# Altium project buck-boost.PrjPcb
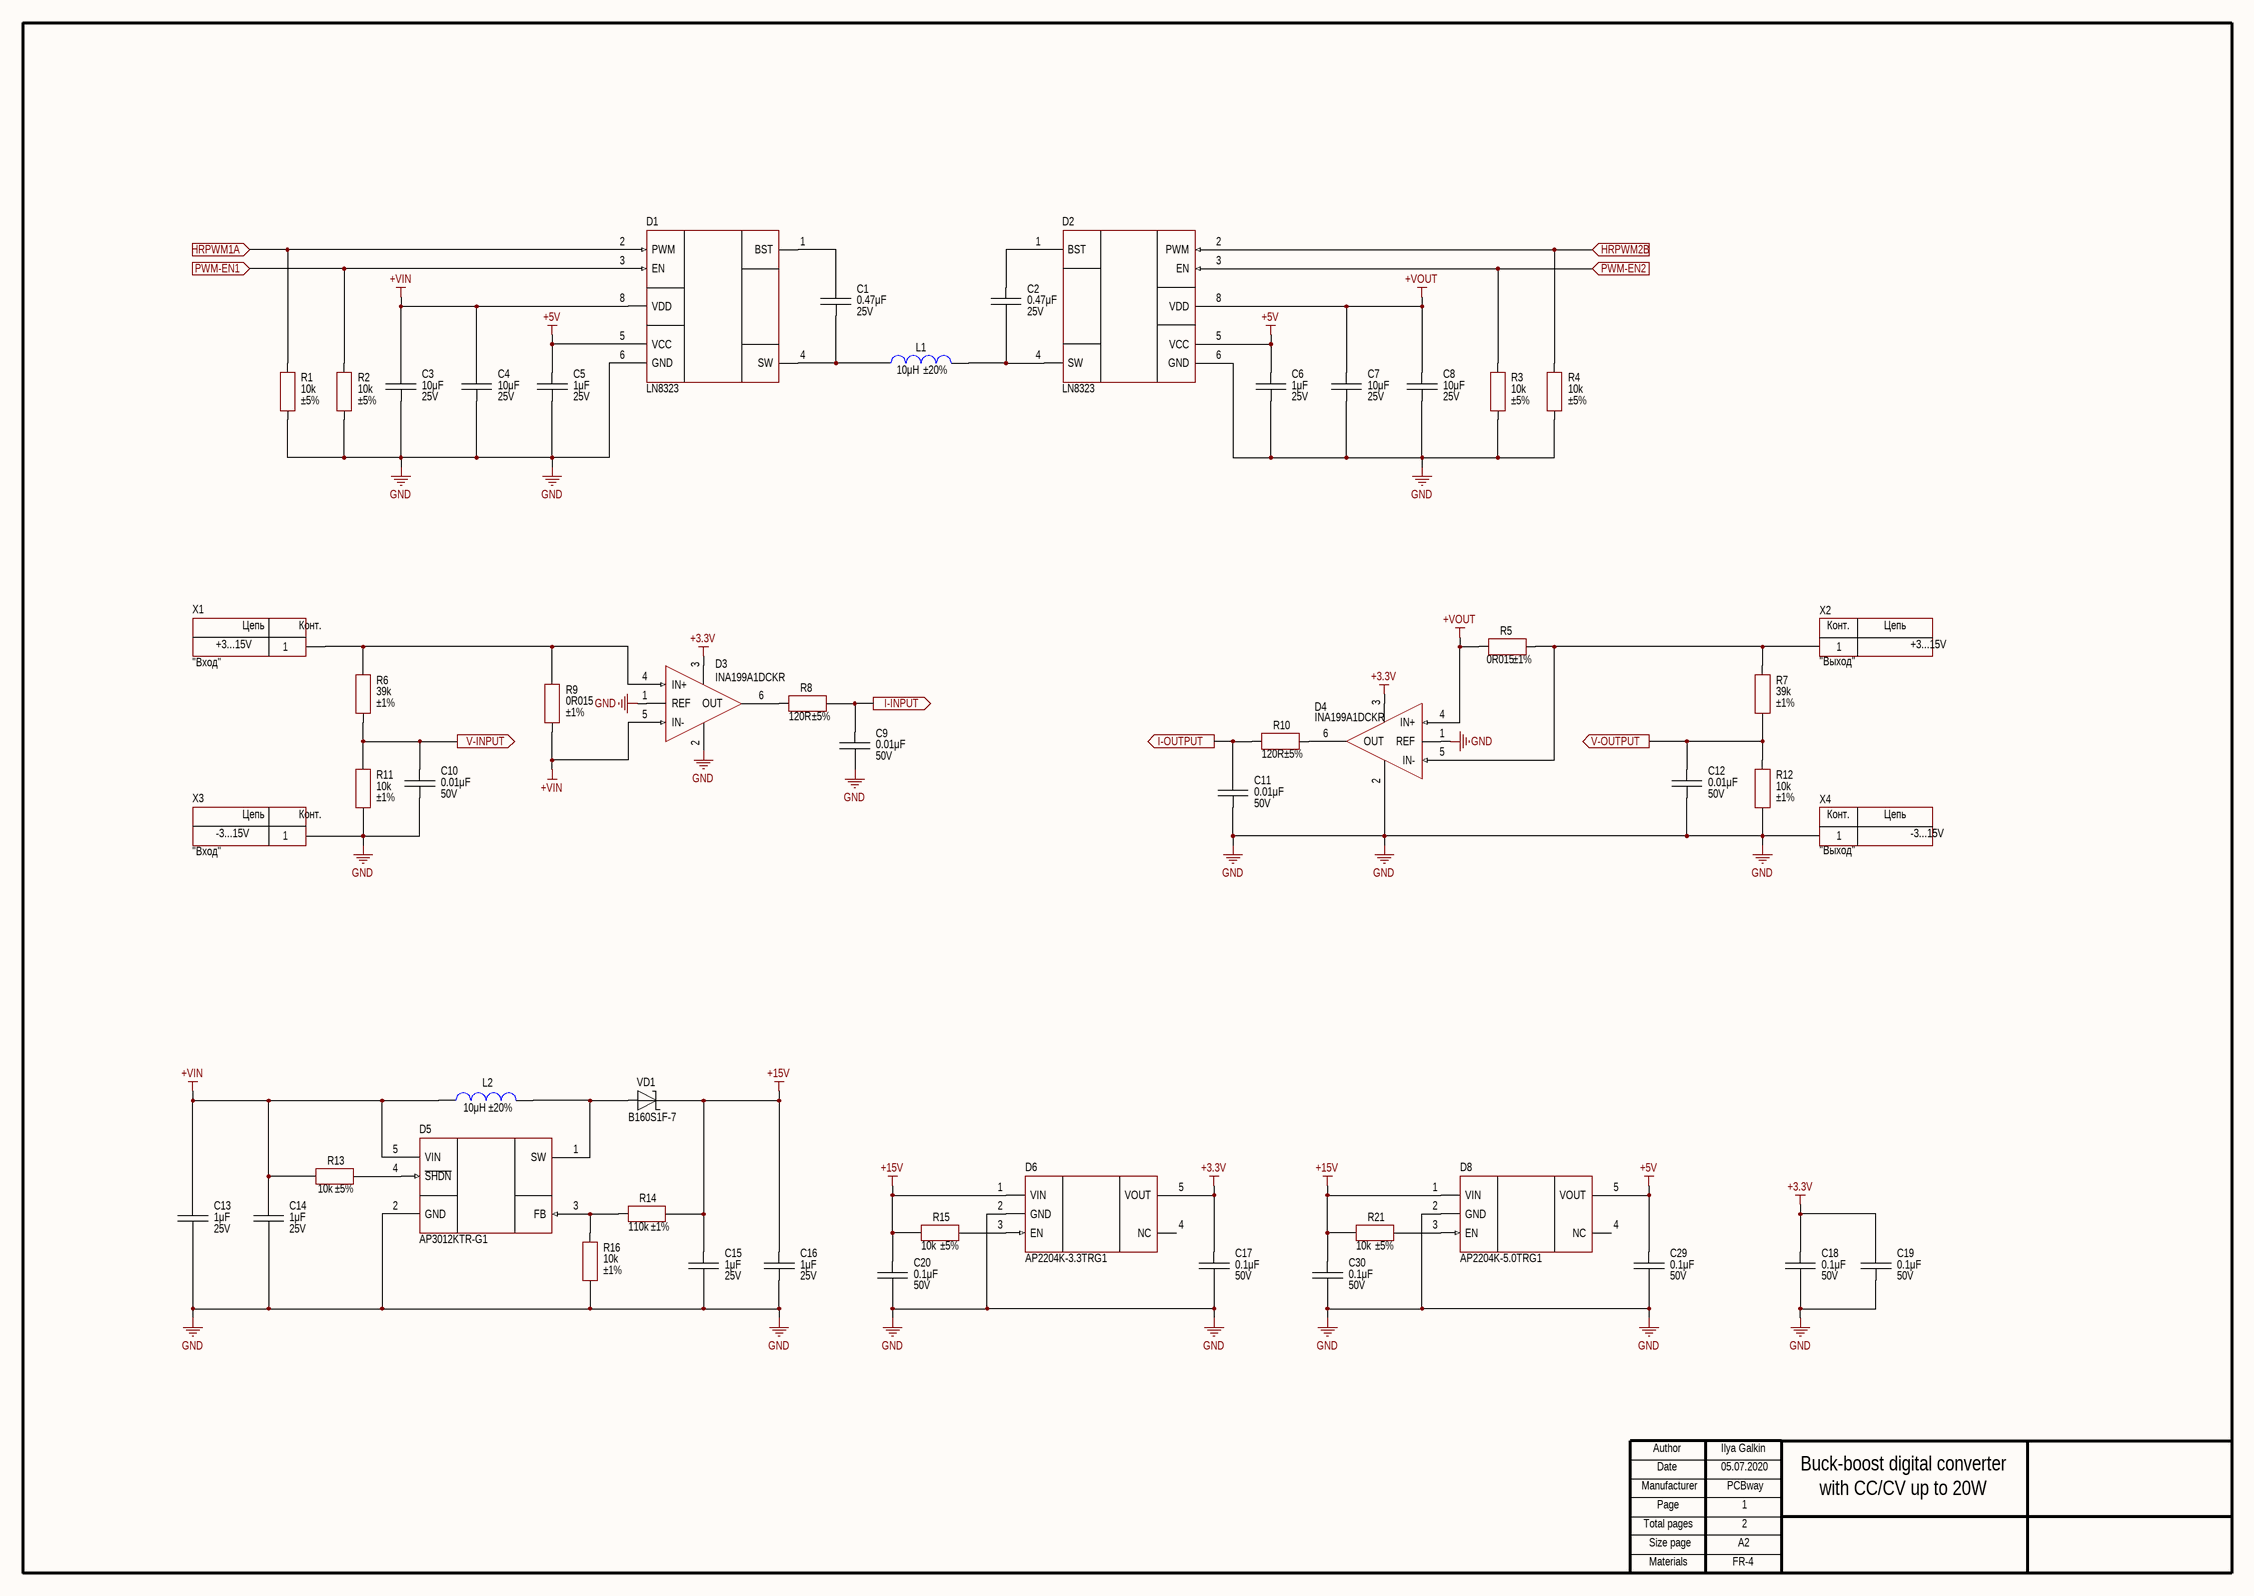
[diagram p0: converter.SchDoc]
2 sheets, 79 parts. Net scope: flat (ports and power ports of the same name join across sheets).
Board file: pcb.PcbDoc
Sheets:
  converter.SchDoc
  dsp.SchDoc

## Sheet converter.SchDoc
size 594 x 420 mm; Address1: Address1; Address2: Address2; Address3: Address3; Address4: Address4; DocumentNumber: АБВГ.123456.001 Э3; SheetNumber: 1; SheetTotal: 2; Scale: 1:1; DocumentType: Схема электрическая принципиальная; FirstReferrence: АБВГ.123456.001

### Parts
(Parts that share a designator on the sheet are numbered #1, #2 ... from top to bottom, then left to right.)
C1  value 0.47μF  Voltage: 25V  [CAP: 0805]
C2  value 0.47μF  Voltage: 25V  [CAP: 0805]
C3  value 10μF  Voltage: 25V  [CAP: 1210]
C4  value 10μF  Voltage: 25V  [CAP: 1210]
C5  value 1μF  Voltage: 25V  [CAP: 0603]
C6  value 1μF  Voltage: 25V  [CAP: 0603]
C7  value 10μF  Voltage: 25V  [CAP: 1210]
C8  value 10μF  Voltage: 25V  [CAP: 1210]
C9  value 0.01μF  Voltage: 50V  [CAP: 0603]
C10  value 0.01μF  Voltage: 50V  [CAP: 0603]
C11  value 0.01μF  Voltage: 50V  [CAP: 0603]
C12  value 0.01μF  Voltage: 50V  [CAP: 0603]
C13  value 1μF  Voltage: 25V  [CAP: 0603]
C14  value 1μF  Voltage: 25V  [CAP: 0603]
C15  value 1μF  Voltage: 25V  [CAP: 0603]
C16  value 1μF  Voltage: 25V  [CAP: 0603]
C17  value 0.1μF  Voltage: 50V  [CAP: 0603]
C18  value 0.1μF  Voltage: 50V  [CAP: 0603]
C19  value 0.1μF  Voltage: 50V  [CAP: 0603]
C20  value 0.1μF  Voltage: 50V  [CAP: 0603]
C29#1  value 0.1μF  Voltage: 50V  [CAP: 0603]
C30#1  value 0.1μF  Voltage: 50V  [CAP: 0603]
D1  (no value)  [8-SOIC-PAD]
D2  (no value)  [8-SOIC-PAD]
D3  (no value)  [SC70-6]
D4  (no value)  [SC70-6]
D5  (no value)  [SOT23-5]
D6#1  (no value)  [SOT23-5]
D8  PartNumber: AP2204K-5.0TRG1  [SOT23-5]
L1  value 10μH  Tolerance: ±20%  [IND: SRP1038C]
L2  value 10μH  Tolerance: ±20%  [IND: SDR0403]
R1  value 10k  Tolerance: ±5%  [RES: 0603]
R2  value 10k  Tolerance: ±5%  [RES: 0603]
R3  value 10k  Tolerance: ±5%  [RES: 0603]
R4  value 10k  Tolerance: ±5%  [RES: 0603]
R5  value 0R015  Tolerance: ±1%  [RES: CSS2H (2512)]
R6  value 39k  Tolerance: ±1%  [RES: 0603]
R7  value 39k  Tolerance: ±1%  [RES: 0603]
R8  value 120R  Tolerance: ±5%  [RES: 0603]
R9  value 0R015  Tolerance: ±1%  [RES: CSS2H (2512)]
R10  value 120R  Tolerance: ±5%  [RES: 0603]
R11  value 10k  Tolerance: ±1%  [RES: 0603]
R12  value 10k  Tolerance: ±1%  [RES: 0603]
R13  value 10k  Tolerance: ±5%  [RES: 0603]
R14  value 110k  Tolerance: ±1%  [RES: 0603]
R15  value 10k  Tolerance: ±5%  [RES: 0603]
R16  value 10k  Tolerance: ±1%  [RES: 0603]
R21  value 10k  Tolerance: ±5%  [RES: 0603]
VD1  PartNumber: B160S1F-7  [DIODE: SOD123F]
X1  CommentText: "Вход"  [CON: 8191]
X2  CommentText: "Выход"  [CON: 8191]
X3  CommentText: "Вход"  [CON: 8191]
X4  CommentText: "Выход"  [CON: 8191]

### Ports
HRPWM1A (in), HRPWM2B (in), I-INPUT (out), I-OUTPUT (out), PWM-EN1 (in), PWM-EN2 (in), V-INPUT (out), V-OUTPUT (out)

### Nets
+3.3V: C17.2 C18.2 C19.2 D3.3(V+) D4.3(V+) D6#1.5(VOUT)
+5V: C5.2 C6.2 C29#1.2 D1.5(VCC) D2.5(VCC) D8.5(VOUT)
+15V: C15.2 C16.2 C20.2 C30#1.2 D6#1.1(VIN) D8.1(VIN) R14.1 R15.2 R21.2 VD1.2
+VIN: C3.2 C4.2 C13.2 C14.2 D1.8(VDD) D3.5(IN-) D5.5(VIN) L2.2 R9.2 R13.2
+VOUT: C7.2 C8.2 D2.8(VDD) D4.4(IN+) R5.1
GND: C3.1 C4.1 C5.1 C6.1 C7.1 C8.1 C9.1 C10.1 C11.1 C12.1 C13.1 C14.1 C15.1 C16.1 C17.1 C18.1 C19.1 C20.1 C29#1.1 C30#1.1 D1.6(GND) D2.6(GND) D3.1(REF) D3.2(V-) D4.1(REF) D4.2(V-) D5.2(GND) D6#1.2(GND) D8.2(GND) R1.1 R2.1 R3.1 R4.1 R11.1 R12.1 R16.1 X3.1 X4.1
NetC1_1: C1.1 D1.4(SW) L1.2
NetC1_2: C1.2 D1.1(BST)
NetC2_1: C2.1 D2.4(SW) L1.1
NetC2_2: C2.2 D2.1(BST)
NetC9_2: C9.2 R8.2 ; port I-INPUT
NetC10_2: C10.2 R6.1 R11.2 ; port V-INPUT
NetC11_2: C11.2 R10.1 ; port I-OUTPUT
NetC12_2: C12.2 R7.1 R12.2 ; port V-OUTPUT
NetD1_2: D1.2(PWM) R1.2 ; port HRPWM1A
NetD1_3: D1.3(EN) R2.2 ; port PWM-EN1
NetD2_2: D2.2(PWM) R4.2 ; port HRPWM2B
NetD2_3: D2.3(EN) R3.2 ; port PWM-EN2
NetD3_4: D3.4(IN+) R6.2 R9.1 X1.1
NetD3_6: D3.6(OUT) R8.1
NetD4_5: D4.5(IN-) R5.2 R7.2 X2.1
NetD4_6: D4.6(OUT) R10.2
NetD5_1: D5.1(SW) L2.1 VD1.1
NetD5_3: D5.3(FB) R14.2 R16.2
NetD5_4: D5.4(~{SHDN}) R13.1
NetD6#1_3: D6#1.3(EN) R15.1
NetD8_3: D8.3(EN) R21.1

Not connected (* = marked no-connect by the designer): D6#1 4(NC); D8 4(NC)

### Notes on the sheet
- +3...15V
- -3...15V
- Ilya Galkin
- 05.07.2020
- PCBway
- 1
- Buck-boost digital converter
- with CC/CV up to 20W
- 2
- FR-4
- Author
- Manufacturer
- Date
- Page
- Total pages
- Size page
- A2
- Materials
- (in symbol Connector_single_power) Цепь; Конт.

### Library data of the parts
C1 C2 = Ceramic_0805: Manufacturer: Samsung; PartNumber: CL21B474KAFNNNG; ValueManufacturerPartNumber: Ceramic capacitor, 0.47μF, X7R, ±10%, 25V, 0805, -55...+125°C; TypeCapacitor: Ceramic capacitor; Tolerance: ±10%; TypeDielectric: X7R; Package: 0805; HelpURL: https://www.digikey.com/product-detail/en/samsung-electro-mechanics/CL21B474KAFNNNG/1276-6480-1-ND/5958108; Temperature: -55...+125°C
C3 C4 C7 C8 = Ceramic_1210: Manufacturer: Samsung; PartNumber: CL32B106KAJNNNE; ValueManufacturerPartNumber: Ceramic capacitor, 10μF, X7R, ±10%, 25V, 1210, -55...+125°C; TypeCapacitor: Ceramic capacitor; Tolerance: ±10%; TypeDielectric: X7R; Package: 1210; HelpURL: https://www.digikey.com/product-detail/en/samsung-electro-mechanics/CL32B106KAJNNNE/1276-1807-1-ND/3889893; Temperature: -55...+125°C
C5 C6 C13-C16 = Ceramic_0603: Manufacturer: Samsung; PartNumber: CL10B105KA8NNNC; ValueManufacturerPartNumber: Ceramic capacitor, 1μF, X7R, ±10%, 25V, 0603, -55...+125°C; TypeCapacitor: Ceramic capacitor; Tolerance: ±10%; TypeDielectric: X7R; Package: 0603; HelpURL: https://www.digikey.com/product-detail/en/samsung-electro-mechanics/CL10B105KA8NNNC/1276-1184-1-ND/3889270; Temperature: -55...+125°C
C9-C12 = Ceramic_0603: Manufacturer: Yageo; PartNumber: CL10B103KB8NNNC; ValueManufacturerPartNumber: Ceramic capacitor, 0.01μF, X7R, ±10%, 50V, 0603, -55...+125°C; TypeCapacitor: Ceramic capacitor; Tolerance: ±10%; TypeDielectric: X7R; Package: 0603; HelpURL: https://www.digikey.com/product-detail/en/samsung-electro-mechanics/CL10B103KB8NNNC/1276-1009-1-ND/3889095; Temperature: -55...+125°C
C17-C20 C29#1 C30#1 = Ceramic_0603: Manufacturer: Yageo; PartNumber: CL10B104KB8WPND; ValueManufacturerPartNumber: Ceramic capacitor, 0.1μF, X7R, ±10%, 50V, 0603, -55...+125°C; TypeCapacitor: Ceramic capacitor; Tolerance: ±10%; TypeDielectric: X7R; Package: 0603; HelpURL: https://www.digikey.com/product-detail/en/samsung-electro-mechanics/CL10B104KB8WPND/1276-CL10B104KB8WPNDCT-ND/11488014; Temperature: -55...+125°C
D1 D2 = LN8323: Gate driver; Manufacturer: Chipown; ValueManufacturerPartNumber: Half-bridge module, 2N channel, 100kHz, 6A, supply 4...30V, -40...+125°C, 8-SOIC-PAD; VoltageSupply: supply 4...30V; Frequency: 100kHz; CurrentOutput: 6A; VoltageWork: 2N channel; HelpURL: http://chipown.com/product.asp?id=416; Package: 8-SOIC-PAD; ComponentType: Half-bridge module; Temperature: -40...+125°C; PartNumber: LN8323
D3 D4 = INA199A1DCKR: Current monitor; Manufacturer: Texas Instruments; ValueManufacturerPartNumber: IC current monitor, ±1.5%, 50V/V, -0.3...+26V, -40...+125°C, SOT23-5; Supply: -0.3...+26V; Accuracy: ±1.5%; GainBandwidth: 50V/V; HelpURL: https://www.digikey.com/product-detail/en/texas-instruments/INA199A1DCKR/296-27329-1-ND/2279290; Package: SOT23-5; ComponentType: IC current monitor; Temperature: -40...+125°C; PartNumber: INA199A1DCKR
D5 = AP3012KTR-G1: Boost converter; Manufacturer: Diodes Incorporated; ValueManufacturerPartNumber: DC/DC boost converter, input 2.6...16V, 1.5MHz, output 3...29V, 0.5A, -40...+85°C, SOT23-5; VoltageInput: input 2.6...16V; Frequency: 1.5MHz; CurrentOutput: 0.5A; VoltageOutput: output 3...29V; HelpURL: https://www.digikey.com/product-detail/en/diodes-incorporated/AP3012KTR-G1/AP3012KTR-G1DICT-ND/4505297; Package: SOT23-5; ComponentType: DC/DC boost converter; Temperature: -40...+85°C; PartNumber: AP3012KTR-G1
D6#1 = AP2204K-3.3TRG1: Linear voltage regulator; Manufacturer: Diodes Incorporated; ValueManufacturerPartNumber: Linear voltage regulator, input 4...24V, 0.5V, output 3.3V, 0.15A, -40...+85°C, SOT23-6; VoltageInput: input 4...24V; MaxDropout: 0.5V; CurrentOutput: 0.15A; VoltageOutput: output 3.3V; HelpURL: https://www.digikey.com/product-detail/en/diodes-incorporated/AP2204K-3.3TRG1/AP2204K-3.3TRG1DICT-ND/4505288; Package: SOT23-6; ComponentType: Linear voltage regulator; Temperature: -40...+85°C; PartNumber: AP2204K-3.3TRG1
D8 = AP2204K-3.3TRG1: Linear voltage regulator; Manufacturer: Diodes Incorporated; ValueManufacturerPartNumber: Linear voltage regulator, input 4...24V, 0.5V, output 5V, 0.15A, -40...+85°C, SOT23-6; VoltageInput: input 4...24V; MaxDropout: 0.5V; CurrentOutput: 0.15A; VoltageOutput: output 5V; HelpURL: https://www.digikey.com/product-detail/en/diodes-incorporated/AP2204K-5-0TRG1/AP2204K-5-0TRG1DICT-ND/4505289; Package: SOT23-6; ComponentType: Linear voltage regulator; Temperature: -40...+85°C
L1 = Inductor_SRP1038C: Manufacturer: Bourns; PartNumber: SRP1038C-100M; ValueManufacturerPartNumber: Fixed inductor, 10μH, ±20%, SRP1038C, 8.5A, -40...+125°C; TypeInductor: Fixed inductor; MaxCurrent: 8.5A; Package: SRP1038C; HelpURL: https://www.digikey.com/product-detail/en/bourns-inc/SRP1038C-100M/SRP1038C-100MCT-ND/10249149; Temperature: -40...+125°C
L2 = Inductor_SDR0403: Manufacturer: Bourns; PartNumber: SDR0403-100ML; ValueManufacturerPartNumber: Fixed inductor, 10μH, ±20%, SDR0403, 1.15A, -40...+125°C; TypeInductor: Fixed inductor; MaxCurrent: 1.15A; Package: SDR0403; HelpURL: https://www.digikey.com/product-detail/en/bourns-inc/SDR0403-100ML/SDR0403-100MLCT-ND/2127080; Temperature: -40...+125°C
R1-R4 R13 R15 R21 = Resistor_0603: Manufacturer: Yageo; PartNumber: RC0603JR-0710KL; ValueManufacturerPartNumber: Resistor film, 10k, ±5%, 0603, 0.1W, -55...+125°C; TypeResistor: Resistor film; Power: 0.1W; Package: 0603; HelpURL: https://www.digikey.com/product-detail/en/yageo/RC0603JR-0710KL/311-10KGRCT-ND/729647; Temperature: -55...+125°C
R5 R9 = Shunt: Manufacturer: Yageo; PartNumber: PE2512FKE7W0R015L; ValueManufacturerPartNumber: Resistor film, 0R015, ±1%, 2512, 2W, -55...+170°C; TypeResistor: Resistor film; Power: 2W; Package: 2512; HelpURL: https://www.digikey.com/product-detail/en/yageo/PE2512FKE7W0R015L/YAG2165CT-ND/5139613; Temperature: -55...+170°C
R6 R7 = Resistor_0603: Manufacturer: Yageo; PartNumber: RC0603FR-0739KL; ValueManufacturerPartNumber: Resistor film, 39k, ±1%, 0603, 0.1W, -55...+125°C; TypeResistor: Resistor film; Power: 0.1W; Package: 0603; HelpURL: https://www.digikey.com/product-detail/en/yageo/RC0603FR-0739KL/311-39-0KHRCT-ND/730142; Temperature: -55...+125°C
R8 R10 = Resistor_0603: Manufacturer: Yageo; PartNumber: RC0603JR-07120RL; ValueManufacturerPartNumber: Resistor film, 120R, ±5%, 0603, 0.1W, -55...+125°C; TypeResistor: Resistor film; Power: 0.1W; Package: 0603; HelpURL: https://www.digikey.com/product-detail/en/yageo/RC0603JR-07120RL/311-120GRCT-ND/729653; Temperature: -55...+125°C
R11 R12 R16 = Resistor_0603: Manufacturer: Yageo; PartNumber: RC0603FR-0710KL; ValueManufacturerPartNumber: Resistor film, 10k, ±1%, 0603, 0.1W, -55...+125°C; TypeResistor: Resistor film; Power: 0.1W; Package: 0603; HelpURL: https://www.digikey.com/product-detail/en/yageo/RC0603FR-0710KL/311-10-0KHRCT-ND/729827; Temperature: -55...+125°C
R14 = Resistor_0603: Manufacturer: Yageo; PartNumber: RC0603FR-07110KL; ValueManufacturerPartNumber: Resistor film, 110k, ±1%, 0603, 0.1W, -55...+125°C; TypeResistor: Resistor film; Power: 0.1W; Package: 0603; HelpURL: https://www.digikey.com/product-detail/en/yageo/RC0603FR-07110KL/311-110KHRCT-ND/729852; Temperature: -55...+125°C
VD1 = Schottky_single: Manufacturer: Diodes Incorporated; ValueManufacturerPartNumber: Schottky diode, 60B160S1F-7, 1A, 650mV, 45pF, SOD-123F, -55...+150°C; TypeDiode: Schottky diode; Voltage: 60B160S1F-7; Current: 1A; VoltageDrop: 650mV; RecoveryTime: 45pF; Package: SOD-123F; HelpURL: https://www.digikey.com/product-detail/en/diodes-incorporated/B160S1F-7/B160S1F-7DICT-ND/7784161; Temperature: -55...+150°C
X1-X4 = Connector_single_power: Manufacturer: Keystone; ValueManufacturerPartNumber: Power connector, 500V, 15A; PartNumber: 8191; TypeConnector: Power connector; VoltageMax: 500V; CurrentMax: 15A; HelpURL: https://ru.mouser.com/ProductDetail/Keystone-Electronics/8191?qs=lQmX4aIt5iAMQ8PQTpZ%2Fwg%3D%3D

## Sheet dsp.SchDoc
size 420 x 297 mm; Address1: Address1; Address2: Address2; Address3: Address3; Address4: Address4; DocumentNumber: АБВГ.123456.001 Э3; SheetNumber: 2; SheetTotal: 2; Scale: 1:1; DocumentType: Схема электрическая принципиальная; FirstReferrence: АБВГ.123456.001
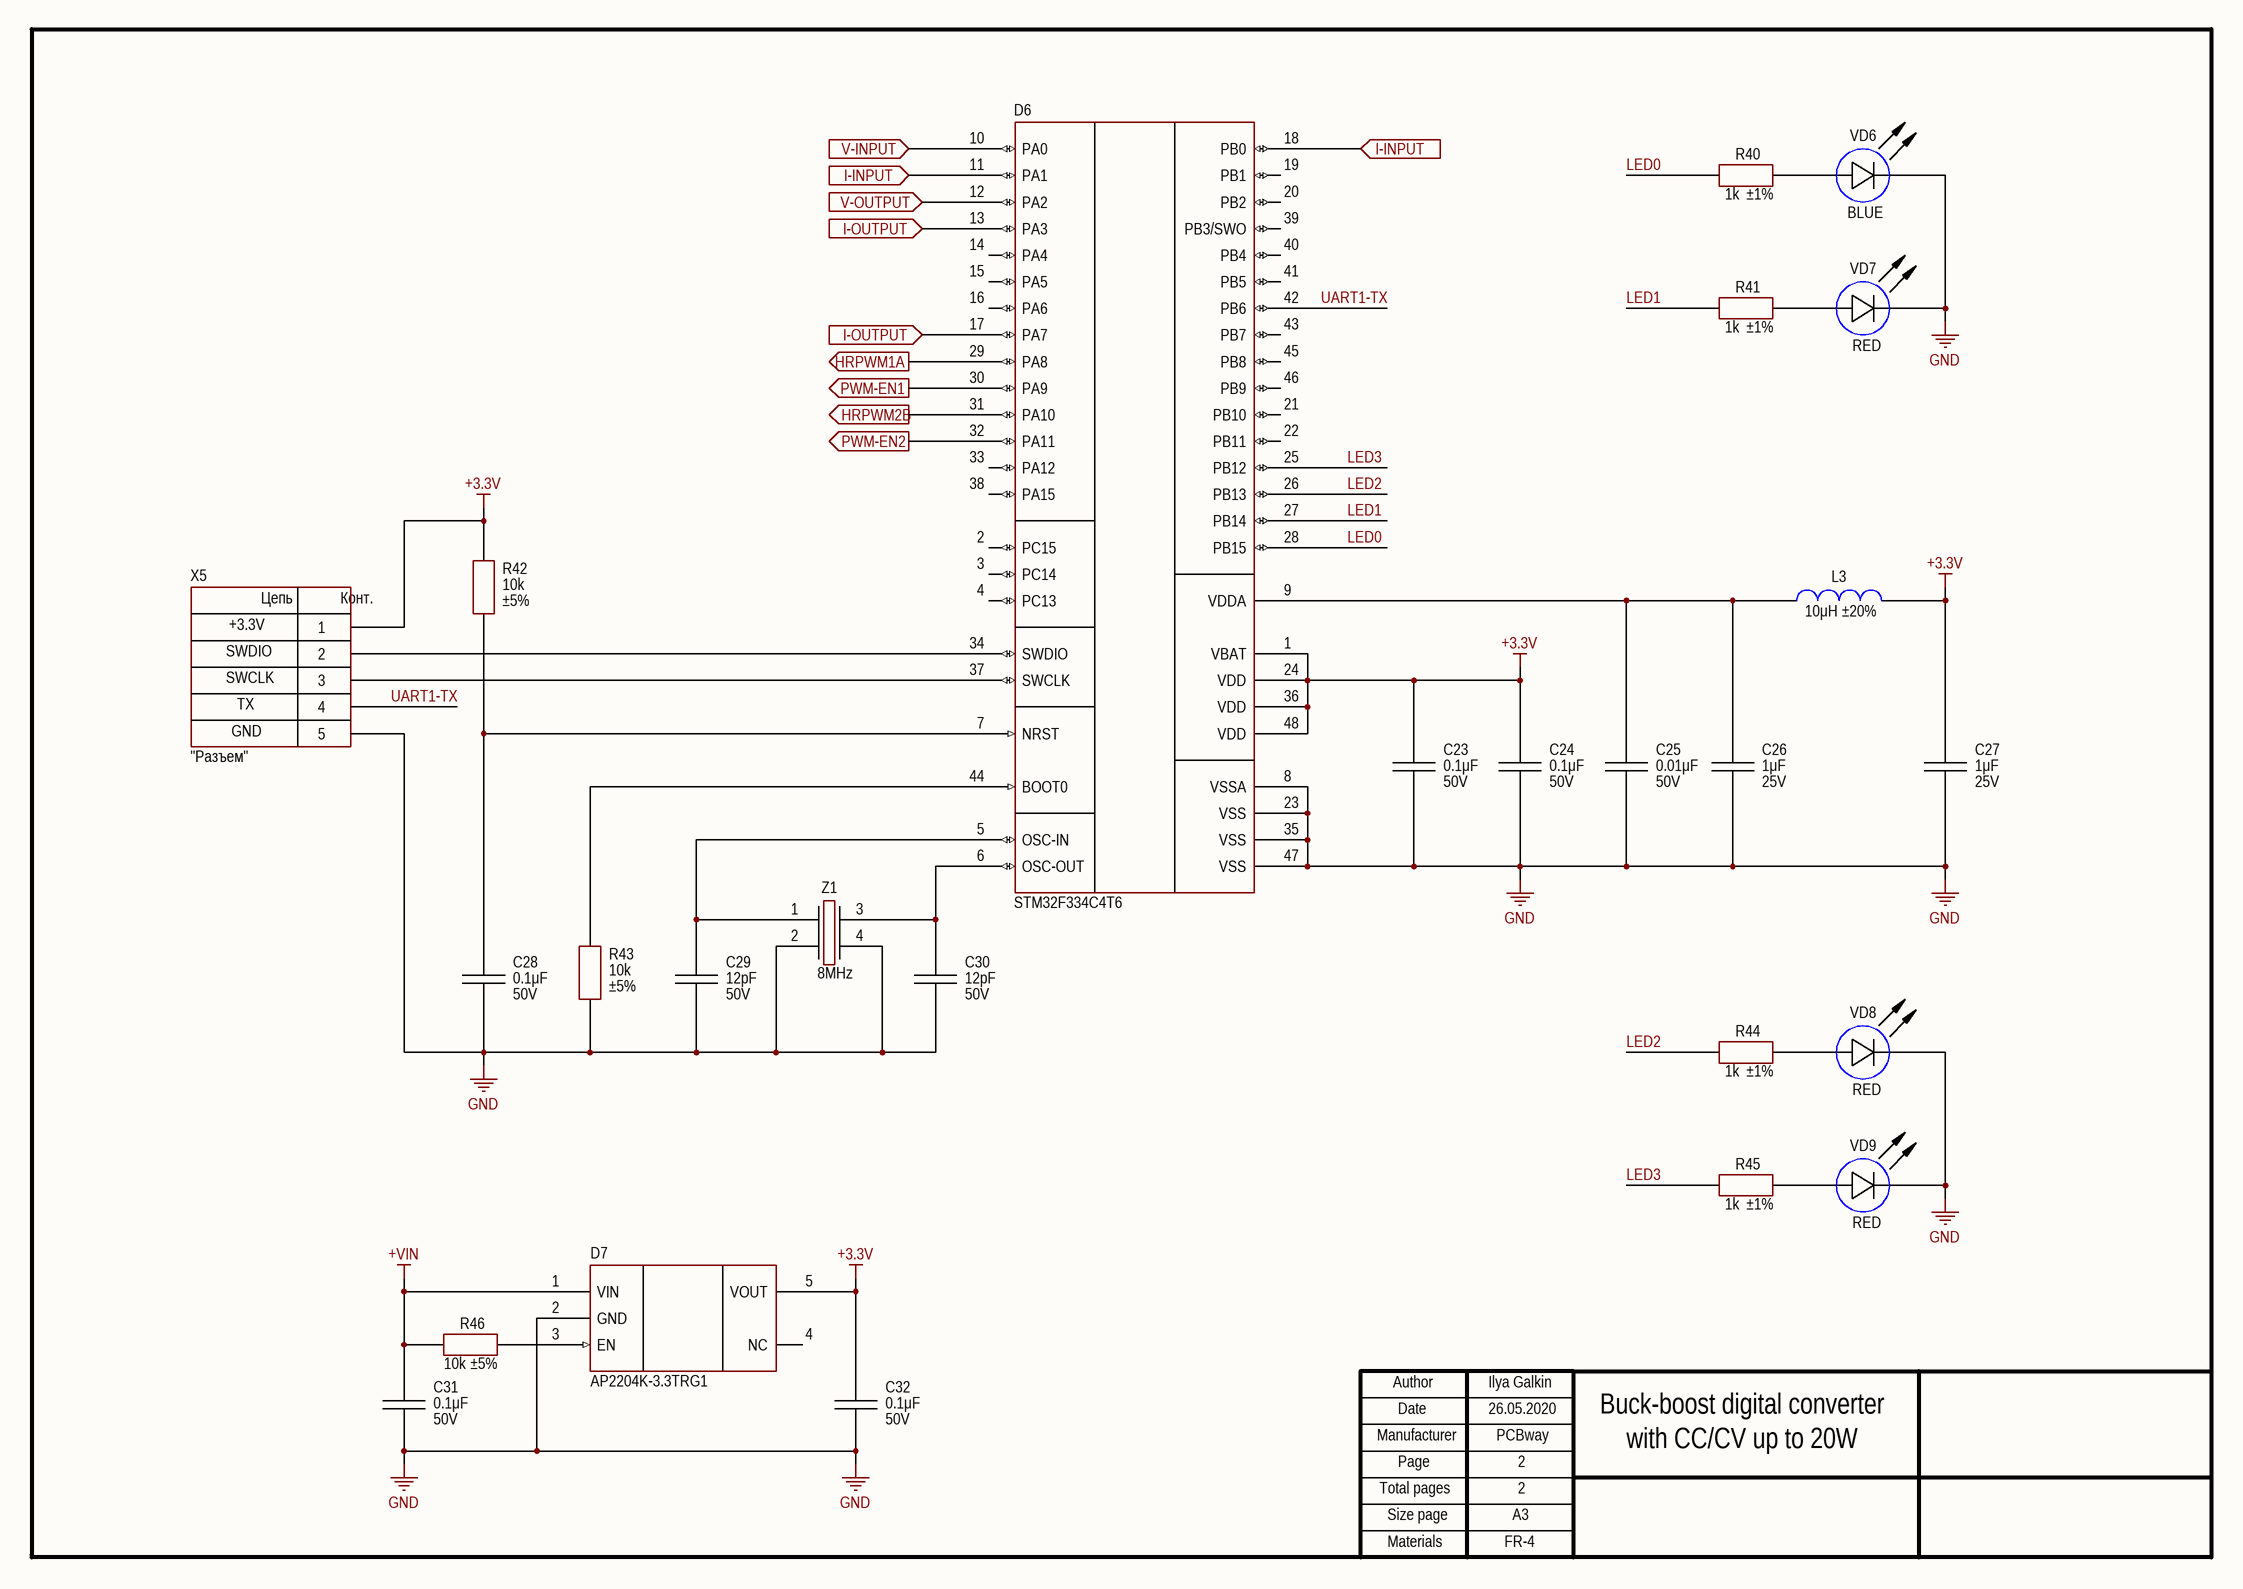
[diagram p1: dsp.SchDoc]

### Parts
(Parts that share a designator on the sheet are numbered #1, #2 ... from top to bottom, then left to right.)
C23  value 0.1μF  Voltage: 50V  [CAP: 0603]
C24  value 0.1μF  Voltage: 50V  [CAP: 0603]
C25  value 0.01μF  Voltage: 50V  [CAP: 0603]
C26  value 1μF  Voltage: 25V  [CAP: 0603]
C27  value 1μF  Voltage: 25V  [CAP: 0603]
C28  value 0.1μF  Voltage: 50V  [CAP: 0603]
C29#2  value 12pF  Voltage: 50V  [CAP: 0603]
C30#2  value 12pF  Voltage: 50V  [CAP: 0603]
C31  value 0.1μF  Voltage: 50V  [CAP: 0603]
C32  value 0.1μF  Voltage: 50V  [CAP: 0603]
D6#2  (no value)  [48-LQFP]
D7  (no value)  [SOT23-5]
L3  value 10μH  Tolerance: ±20%  [IND: 0603]
R40  value 1k  Tolerance: ±1%  [RES: 0603]
R41  value 1k  Tolerance: ±1%  [RES: 0603]
R42  value 10k  Tolerance: ±5%  [RES: 0603]
R43  value 10k  Tolerance: ±5%  [RES: 0603]
R44  value 1k  Tolerance: ±1%  [RES: 0603]
R45  value 1k  Tolerance: ±1%  [RES: 0603]
R46  value 10k  Tolerance: ±5%  [RES: 0603]
VD6  Color: BLUE  [LED: 0603B]
VD7  Color: RED  [LED: 0603R]
VD8  Color: RED  [LED: 0603R]
VD9  Color: RED  [LED: 0603R]
X5  CommentText: "Разъем"  [CON: SM05B-GHS]
Z1  Frequency: 8MHz  [OSC: 3225]

### Ports
HRPWM1A (out), HRPWM2B (out), I-INPUT (in), I-OUTPUT (in), PWM-EN1 (out), PWM-EN2 (out), V-INPUT (in), V-OUTPUT (in)

### Nets
+3.3V: C23.2 C24.2 C27.2 C32.2 D6#2.1(VBAT) D6#2.24(VDD) D6#2.36(VDD) D6#2.48(VDD) D7.5(VOUT) L3.1 R42.2 X5.1
+VIN: C31.2 D7.1(VIN) R46.2
GND: C23.1 C24.1 C25.1 C26.1 C27.1 C28.1 C29#2.1 C30#2.1 C31.1 C32.1 D6#2.8(VSSA) D6#2.23(VSS) D6#2.35(VSS) D6#2.47(VSS) D7.2(GND) R43.1 VD6.2(C) VD7.2(C) VD8.2(C) VD9.2(C) X5.5 Z1.2 Z1.4
LED0: D6#2.28(PB15) R40.2
LED1: D6#2.27(PB14) R41.2
LED2: D6#2.26(PB13) R44.2
LED3: D6#2.25(PB12) R45.2
UART1-TX: D6#2.42(PB6) X5.4
NetC9_2: D6#2.11(PA1) D6#2.18(PB0) ; port I-INPUT
NetC10_2: D6#2.10(PA0) ; port V-INPUT
NetC11_2: D6#2.13(PA3) D6#2.17(PA7) ; port I-OUTPUT
NetC12_2: D6#2.12(PA2) ; port V-OUTPUT
NetC25_2: C25.2 C26.2 D6#2.9(VDDA) L3.2
NetC28_2: C28.2 D6#2.7(NRST) R42.1
NetC29#2_2: C29#2.2 D6#2.5(OSC-IN) Z1.1
NetC30#2_2: C30#2.2 D6#2.6(OSC-OUT) Z1.3
NetD1_2: D6#2.29(PA8) ; port HRPWM1A
NetD1_3: D6#2.30(PA9) ; port PWM-EN1
NetD2_2: D6#2.31(PA10) ; port HRPWM2B
NetD2_3: D6#2.32(PA11) ; port PWM-EN2
NetD6#2_34: D6#2.34(SWDIO) X5.2
NetD6#2_37: D6#2.37(SWCLK) X5.3
NetD6#2_44: D6#2.44(BOOT0) R43.2
NetD7_3: D7.3(EN) R46.1
NetR40_1: R40.1 VD6.1(A)
NetR41_1: R41.1 VD7.1(A)
NetR44_1: R44.1 VD8.1(A)
NetR45_1: R45.1 VD9.1(A)

Not connected (* = marked no-connect by the designer): D6#2 2(PC15) 3(PC14) 4(PC13) 14(PA4) 15(PA5) 16(PA6) 19(PB1) 20(PB2) 21(PB10) 22(PB11) 33(PA12) 38(PA15) 39(PB3/SWO) 40(PB4) 41(PB5) 43(PB7) 45(PB8) 46(PB9); D7 4(NC)

### Notes on the sheet
- SWDIO
- +3.3V
- SWCLK
- TX
- GND
- Ilya Galkin
- 26.05.2020
- PCBway
- 2
- Buck-boost digital converter
- with CC/CV up to 20W
- FR-4
- Author
- Manufacturer
- Date
- Page
- Total pages
- Size page
- A3
- Materials
- (in symbol Connector_SM05B) Цепь; Конт.

### Library data of the parts
C23 C24 C28 C31 C32 = Ceramic_0603: as C17 on sheet converter; Package: 0603; HelpURL: https://www.digikey.com/product-detail/en/samsung-electro-mechanics/CL10B104KB8WPND/1276-CL10B104KB8WPNDCT-ND/11488014; Temperature: -55...+125°C
C25 = Ceramic_0603: as C9 on sheet converter; Package: 0603; HelpURL: https://www.digikey.com/product-detail/en/samsung-electro-mechanics/CL10B103KB8NNNC/1276-1009-1-ND/3889095; Temperature: -55...+125°C
C26 C27 = Ceramic_0603: as C5 on sheet converter; Package: 0603; HelpURL: https://www.digikey.com/product-detail/en/samsung-electro-mechanics/CL10B105KA8NNNC/1276-1184-1-ND/3889270; Temperature: -55...+125°C
C29#2 C30#2 = Ceramic_0603: Manufacturer: Samsung; PartNumber: CL10C120JB8NNNC; ValueManufacturerPartNumber: Ceramic capacitor, 12pF, NPO, ±10%, 50V, 0603, -55...+125°C; TypeCapacitor: Ceramic capacitor; Tolerance: ±10%; TypeDielectric: NPO; Package: 0603; HelpURL: https://www.digikey.com/product-detail/en/samsung-electro-mechanics/CL10C120JB8NNNC/1276-1254-1-ND/3889340; Temperature: -55...+125°C
D6#2 = STM32F334C4T6: Cortex-M4; Manufacturer: STMicroelectronics; ValueManufacturerPartNumber: IC microcontroller, 32-Bit, Cortex-M4, 72MHz, 16KB, 12KB, 2...3.6V, -40...+85°C, 48-LQFP; Supply: 2...3.6V; Speed: 72MHz; CoreSize: 32-Bit; MemoryROM: 16KB; MemoryRAM: 12KB; HelpURL: https://www.digikey.com/products/en?keywords=STM32F334C4T6; Package: 48-LQFP; ComponentType: IC microcontroller; Temperature: -40...+85°C; CoreProcessor: Cortex-M4; PartNumber: STM32F334C4T6
D7 = AP2204K-3.3TRG1: as D6#1 on sheet converter; HelpURL: https://www.digikey.com/product-detail/en/diodes-incorporated/AP2204K-3.3TRG1/AP2204K-3.3TRG1DICT-ND/4505288; Package: SOT23-6; ComponentType: Linear voltage regulator; Temperature: -40...+85°C; PartNumber: AP2204K-3.3TRG1
L3 = Inductor_0603: Manufacturer: Murata Electronics; PartNumber: LQM18FN100M00D; ValueManufacturerPartNumber: Fixed inductor, 10μH, ±20%, 0603, 50mA, -55...+125°C; TypeInductor: Fixed inductor; MaxCurrent: 50mA; Package: 0603; HelpURL: https://www.digikey.com/product-detail/en/murata-electronics-north-america/LQM18FN100M00D/490-4025-1-ND/1016285; Temperature: -55...+125°C
R40 R41 R44 R45 = Resistor_0603: Manufacturer: Yageo; PartNumber: RC0603FR-071KL; ValueManufacturerPartNumber: Resistor film, 1k, ±1%, 0603, 0.1W, -55...+125°C; TypeResistor: Resistor film; Power: 0.1W; Package: 0603; HelpURL: https://www.digikey.com/product-detail/en/yageo/RC0603FR-071KL/311-1-00KHRCT-ND/729790; Temperature: -55...+125°C
R42 R43 R46 = Resistor_0603: as R1 on sheet converter; Package: 0603; HelpURL: https://www.digikey.com/product-detail/en/yageo/RC0603JR-0710KL/311-10KGRCT-ND/729647; Temperature: -55...+125°C
VD6 = LED_single: Manufacturer: Wurth; ValueManufacturerPartNumber: LED, 20mA, 3.2V, 0603, -55...+150°C; PartNumber: 150060BS75000; TypeDiode: LED; Current: 20mA; VoltageDrop: 3.2V; Package: 0603; HelpURL: https://www.digikey.com/product-detail/en/w-rth-elektronik/150060BS75000/732-4966-1-ND/4489893; Temperature: -55...+150°C
VD7-VD9 = LED_single: Manufacturer: Wurth; ValueManufacturerPartNumber: LED, 20 mA, 2V, 0603, -55...+150°C; PartNumber: 150060RS75000; TypeDiode: LED; Current: 20 mA; VoltageDrop: 2V; Package: 0603; HelpURL: https://www.digikey.com/product-detail/en/w-rth-elektronik/150060RS75000/732-4978-1-ND/4489899; Temperature: -55...+150°C
X5 = Connector_SM05B: Manufacturer: JST; ValueManufacturerPartNumber: Connector, 5pin, 1.25mm, 50VDC, 1A; PartNumber: SM05B-GHS; VoltageMax: 50VDC; Pitch: 1.25mm; CurrentMax: 1A; Multichannel: 5pin; HelpURL: https://www.digikey.com/product-detail/en/jst-sales-america-inc/SM05B-GHS-TB-LF-SN/455-1567-1-ND/807835; TypeConnector: Connector
Z1 = Crystal_3225: Manufacturer: ECS; PartNumber: ECS-80-12-33-JGN-TR; ValueManufacturerPartNumber: Crystal, 8MHz, 12pF, ±30ppm, case 3225, -40...+85°C; LoadCapacitance: 12pF; Tolerance: ±30ppm; Package: case 3225; HelpURL: https://www.digikey.com/product-detail/en/ecs-inc/ECS-80-12-33-JGN-TR/50-ECS-80-12-33-JGN-CT-ND/10478769; Temperature: -40...+85°C; TypeOscilator: Crystal

## Nets that join several sheets
+3.3V: converter (6 pins), dsp (12 pins)
+VIN: converter (10 pins), dsp (C31.2 D7.1 R46.2)
GND: converter (38 pins), dsp (23 pins)
NetC9_2: converter (C9.2 R8.2), dsp (D6#2.11 D6#2.18)
NetC10_2: converter (C10.2 R6.1 R11.2), dsp (D6#2.10)
NetC11_2: converter (C11.2 R10.1), dsp (D6#2.13 D6#2.17)
NetC12_2: converter (C12.2 R7.1 R12.2), dsp (D6#2.12)
NetD1_2: converter (D1.2 R1.2), dsp (D6#2.29)
NetD1_3: converter (D1.3 R2.2), dsp (D6#2.30)
NetD2_2: converter (D2.2 R4.2), dsp (D6#2.31)
NetD2_3: converter (D2.3 R3.2), dsp (D6#2.32)